# Altium project UKU205V2.PRJPCB
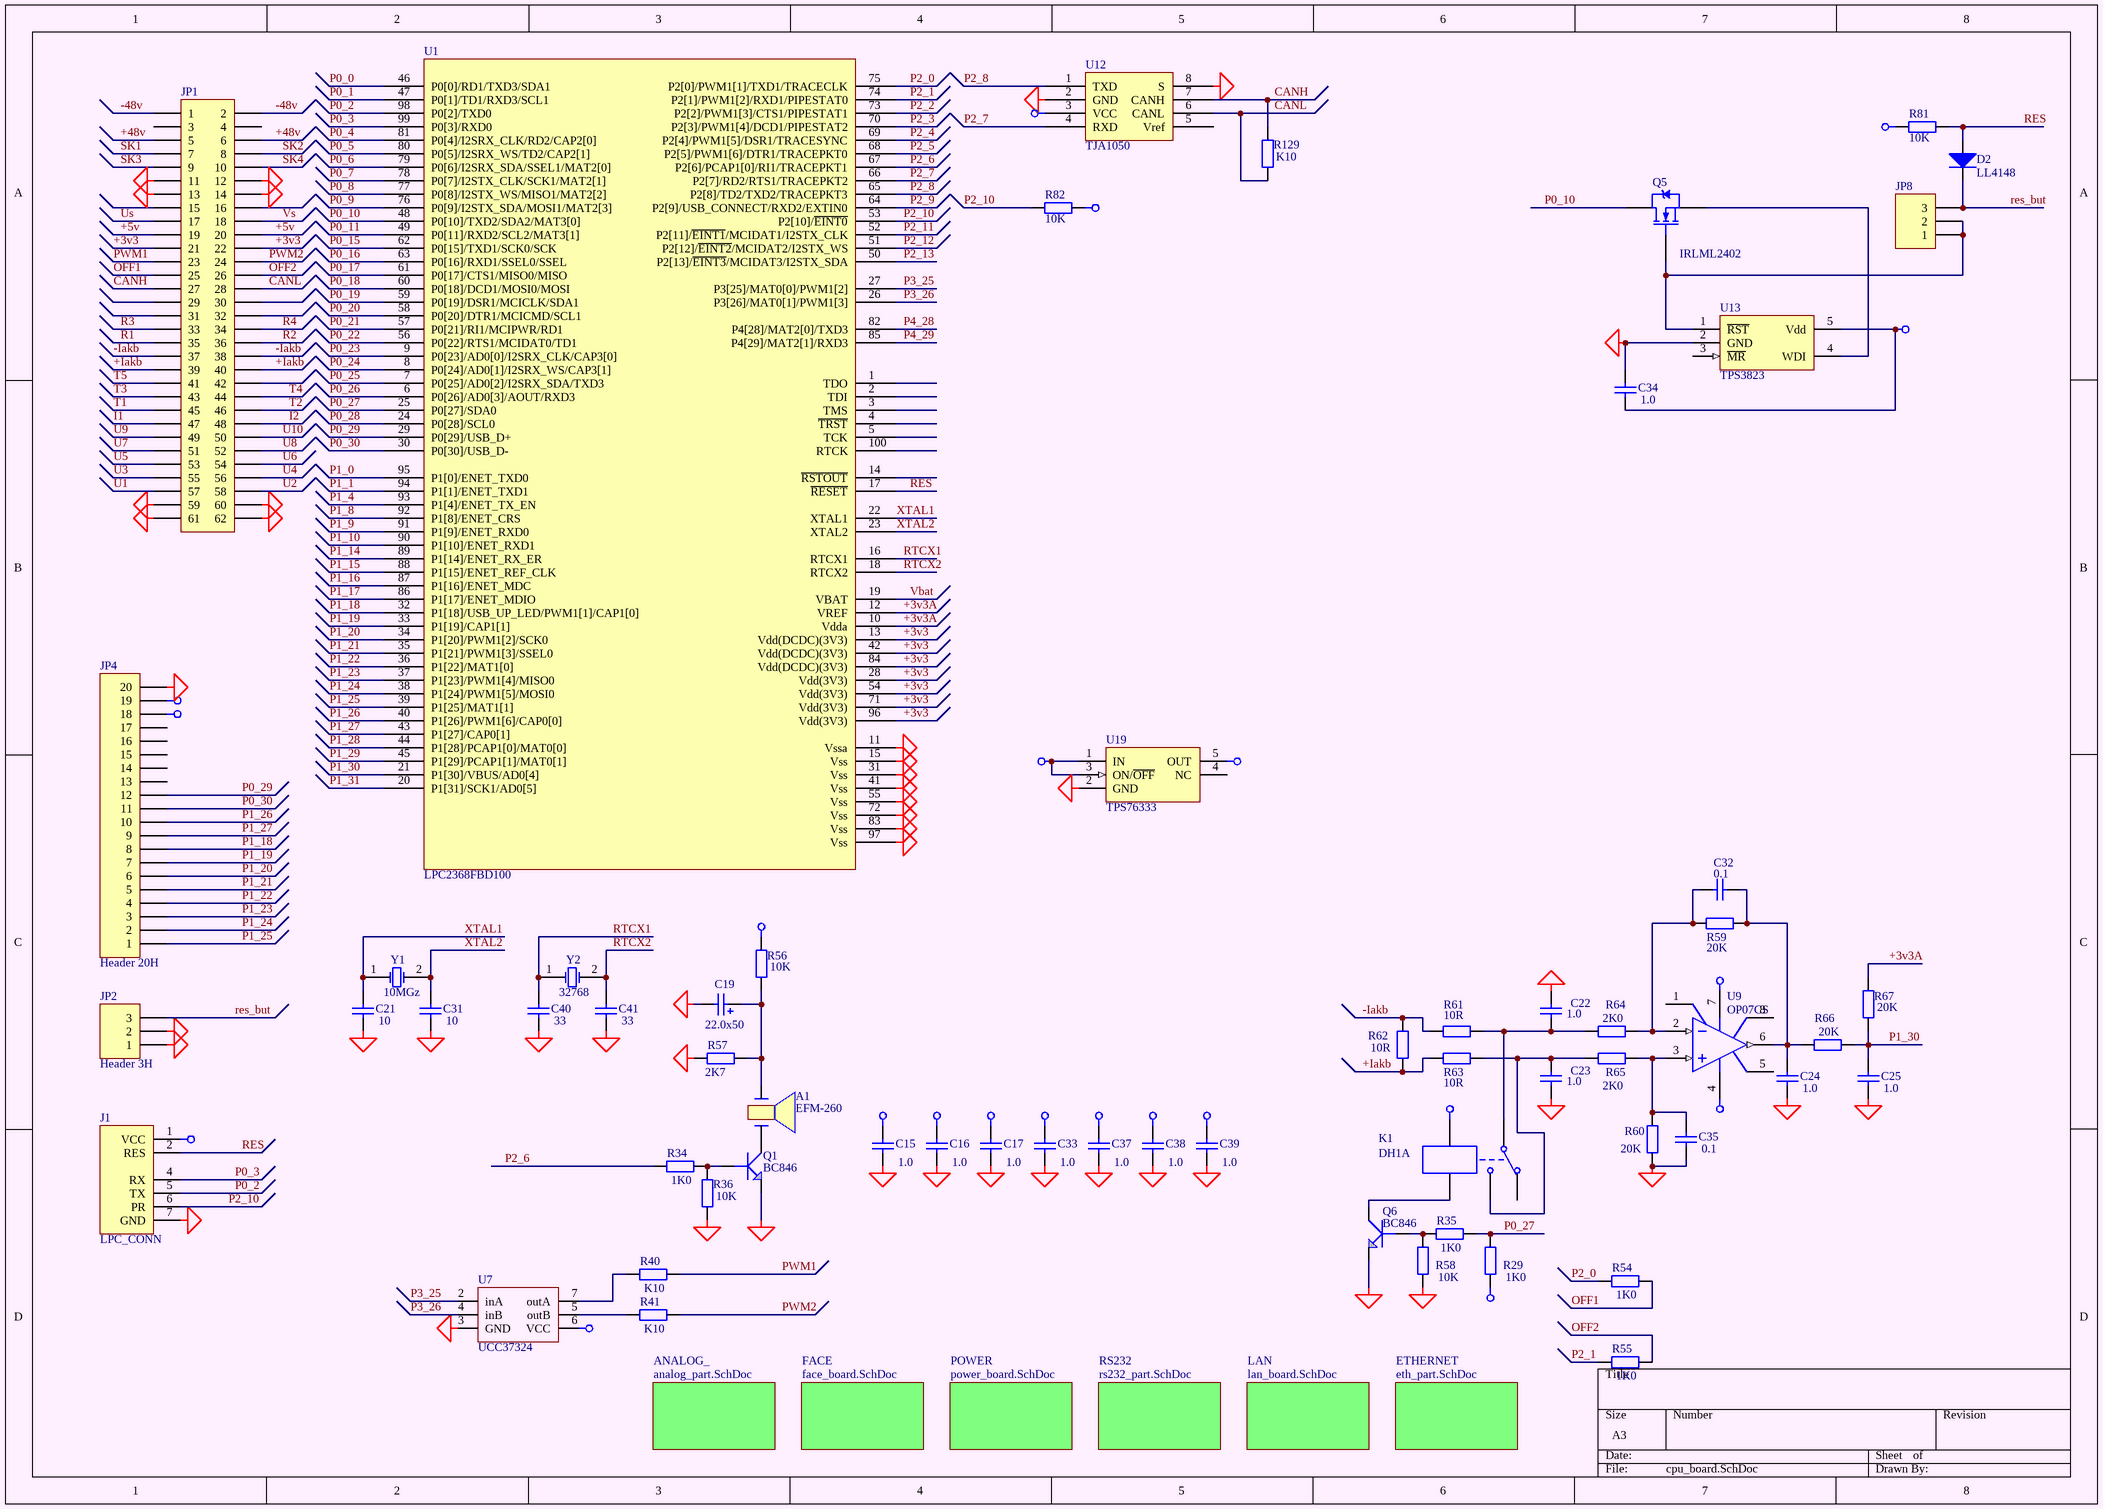
[diagram p0: cpu_board.SchDoc]
6 sheets, 250 parts. Net scope: global (net labels, ports and power ports of the same name join across sheets).
Board file: UKU205.PcbDoc
Sheets:
  cpu_board.SchDoc
    POWER = power_board.SchDoc
    LAN = lan_board.SchDoc
    ETHERNET = eth_part.SchDoc
    FACE = face_board.SchDoc
    ANALOG_ = analog_part.SchDoc

## Sheet cpu_board.SchDoc
size A3

### Parts
A1  EFM-260  [Pjezo15]
C15  1.0  [C3216-1206]
C16  1.0  [C3216-1206]
C17  1.0  [_1206]
C19  22.0x50  [el3]
C21  10  [_1206]
C22  1.0  [_1206]
C23  1.0  [_1206]
C24  1.0  [_1206]
C25  1.0  [_1206]
C31  10  [_1206]
C32  0.1  [_1206]
C33  1.0  [_1206]
C34  1.0  [_1206]
C35  0.1  [_1206]
C37  1.0  [_1206]
C38  1.0  [_1206]
C39  1.0  [_1206]
C40  33  [_1206]
C41  33  [_1206]
D2  LL4148  [_1206d]
J1  LPC_CONN  [HDR1X7]
JP1  (no value)  [HDR2X30]
JP2  Header 3H  [HDR1X3H]
JP4  Header 20H  [HDR1X20H]
JP8  PLS-3  [HDR1X3]  (value not drawn)
K1  DH1A  [kuan]
Q1  BC846  [SO-G3]
Q5  IRLML2402  [SO-G3]
Q6  BC846  [SO-G3]
R29  1K0  [_1206]
R34  1K0  [_1206]
R35  1K0  [_1206]
R36  10K  [_1206]
R40  K10  [_1206]
R41  K10  [_1206]
R54  1K0  [_1206]
R55  1K0  [_1206]
R56  10K  [_1206]
R57  2K7  [_1206]
R58  10K  [_1206]
R59  20K  [_1206]
R60  20K  [_1206]
R61  10R  [_1206]
R62  10R  [_1206]
R63  10R  [_1206]
R64  2K0  [_1206]
R65  2K0  [_1206]
R66  20K  [_1206]
R67  20K  [_1206]
R81  10K  [_1206]
R82  10K  [_1206]
R129  K10  [_1206]
U1  LPC2368FBD100  [LPC2368]
U7  UCC37324  [SO-G8]
U9  OP07CS  [SO-G8]
U12  TJA1050  [SO-G8]
U13  TPS3823  [SO-G5/P.95]
U19  TPS76333  [SO-G5/P.95]
Y1  10MGz  [QWARZ1]
Y2  32768  [QWARZ2]

### Sub-sheets
ANALOG_ = analog_part.SchDoc: no entries
ETHERNET = eth_part.SchDoc: no entries
FACE = face_board.SchDoc: no entries
LAN = lan_board.SchDoc: no entries
POWER = power_board.SchDoc: no entries
RS232 = rs232_part.SchDoc (file not in this document): no entries

### Nets
+3v3: C34.1 C37.2 C38.2 C39.2 J1.1(VCC) JP1.21 JP1.22 R81.2 R82.1 U1.13(Vdd(DCDC)(3V3)) U1.28(Vdd(3V3)) U1.42(Vdd(DCDC)(3V3)) U1.54(Vdd(3V3)) U1.71(Vdd(3V3)) U1.84(Vdd(DCDC)(3V3)) U1.96(Vdd(3V3)) U13.5(Vdd)
+3v3A: C17.2 C33.2 R67.2 U1.10(Vdda) U1.12(VREF) U19.5(OUT)
+5v: C15.2 JP1.19 JP1.20 JP4.19 K1.4 R29.1 U7.6(VCC) U9.7(V+) U12.3(VCC) U19.1(IN) U19.3(ON/~{OFF})
+48v: JP1.5 JP1.6 R56.2
-5v: C16.2 JP4.18 U9.4(V-)
GND: C15.1 C16.1 C17.1 C19.2 C21.1 C22.1 C23.2 C24.1 C25.1 C31.1 C33.1 C34.2 C35.2 C37.1 C38.1 C39.1 C40.1 C41.1 J1.7(GND) JP1.11 JP1.12 JP1.13 JP1.14 JP1.59 JP1.60 JP1.61 JP1.62 JP2.1 JP2.2 JP4.20 Q1.2(E) Q6.2(E) R36.1 R57.1 R58.1 R60.1 U1.11(Vssa) U1.15(Vss) U1.31(Vss) U1.41(Vss) U1.55(Vss) U1.72(Vss) U1.83(Vss) U1.97(Vss) U7.3(GND) U12.2(GND) U12.8(S) U13.2(GND) U19.2(GND)
+Iakb: JP1.39 JP1.40 R62.1 R63.2
-48v: JP1.1 JP1.2
-Iakb: JP1.37 JP1.38 R61.2 R62.2
CANH: JP1.27 R129.2 U12.7(CANH)
CANL: JP1.28 R129.1 U12.6(CANL)
I1: JP1.47
I2: JP1.48
OFF1: JP1.25 R54.2
OFF2: JP1.26 R55.2
P0_0: U1.46(P0[0]/RD1/TXD3/SDA1)
P0_1: U1.47(P0[1]/TD1/RXD3/SCL1)
P0_2: J1.5(TX) U1.98(P0[2]/TXD0)
P0_3: J1.4(RX) U1.99(P0[3]/RXD0)
P0_4: U1.81(P0[4]/I2SRX_CLK/RD2/CAP2[0])
P0_5: U1.80(P0[5]/I2SRX_WS/TD2/CAP2[1])
P0_6: U1.79(P0[6]/I2SRX_SDA/SSEL1/MAT2[0])
P0_7: U1.78(P0[7]/I2STX_CLK/SCK1/MAT2[1])
P0_8: U1.77(P0[8]/I2STX_WS/MISO1/MAT2[2])
P0_9: U1.76(P0[9]/I2STX_SDA/MOSI1/MAT2[3])
P0_10: Q5.3(D) U1.48(P0[10]/TXD2/SDA2/MAT3[0])
P0_11: U1.49(P0[11]/RXD2/SCL2/MAT3[1])
P0_15: U1.62(P0[15]/TXD1/SCK0/SCK)
P0_16: U1.63(P0[16]/RXD1/SSEL0/SSEL)
P0_17: U1.61(P0[17]/CTS1/MISO0/MISO)
P0_18: U1.60(P0[18]/DCD1/MOSI0/MOSI)
P0_19: U1.59(P0[19]/DSR1/MCICLK/SDA1)
P0_20: U1.58(P0[20]/DTR1/MCICMD/SCL1)
P0_21: U1.57(P0[21]/RI1/MCIPWR/RD1)
P0_22: U1.56(P0[22]/RTS1/MCIDAT0/TD1)
P0_23: U1.9(P0[23]/AD0[0]/I2SRX_CLK/CAP3[0])
P0_24: U1.8(P0[24]/AD0[1]/I2SRX_WS/CAP3[1])
P0_25: U1.7(P0[25]/AD0[2]/I2SRX_SDA/TXD3)
P0_26: U1.6(P0[26]/AD0[3]/AOUT/RXD3)
P0_27: R29.2 R35.1 U1.25(P0[27]/SDA0)
P0_28: U1.24(P0[28]/SCL0)
P0_29: JP4.12 U1.29(P0[29]/USB_D+)
P0_30: JP4.11 U1.30(P0[30]/USB_D-)
P1_0: U1.95(P1[0]/ENET_TXD0)
P1_1: U1.94(P1[1]/ENET_TXD1)
P1_4: U1.93(P1[4]/ENET_TX_EN)
P1_8: U1.92(P1[8]/ENET_CRS)
P1_9: U1.91(P1[9]/ENET_RXD0)
P1_10: U1.90(P1[10]/ENET_RXD1)
P1_14: U1.89(P1[14]/ENET_RX_ER)
P1_15: U1.88(P1[15]/ENET_REF_CLK)
P1_16: U1.87(P1[16]/ENET_MDC)
P1_17: U1.86(P1[17]/ENET_MDIO)
P1_18: JP4.8 U1.32(P1[18]/USB_UP_LED/PWM1[1]/CAP1[0])
P1_19: JP4.7 U1.33(P1[19]/CAP1[1])
P1_20: JP4.6 U1.34(P1[20]/PWM1[2]/SCK0)
P1_21: JP4.5 U1.35(P1[21]/PWM1[3]/SSEL0)
P1_22: JP4.4 U1.36(P1[22]/MAT1[0])
P1_23: JP4.3 U1.37(P1[23]/PWM1[4]/MISO0)
P1_24: JP4.2 U1.38(P1[24]/PWM1[5]/MOSI0)
P1_25: JP4.1 U1.39(P1[25]/MAT1[1])
P1_26: JP4.10 U1.40(P1[26]/PWM1[6]/CAP0[0])
P1_27: JP4.9 U1.43(P1[27]/CAP0[1])
P1_28: U1.44(P1[28]/PCAP1[0]/MAT0[0])
P1_29: U1.45(P1[29]/PCAP1[1]/MAT0[1])
P1_30: C25.2 R66.2 R67.1 U1.21(P1[30]/VBUS/AD0[4])
P1_31: U1.20(P1[31]/SCK1/AD0[5])
P2_0: R54.1 U1.75(P2[0]/PWM1[1]/TXD1/TRACECLK)
P2_1: R55.1 U1.74(P2[1]/PWM1[2]/RXD1/PIPESTAT0)
P2_2: U1.73(P2[2]/PWM1[3]/CTS1/PIPESTAT1)
P2_3: U1.70(P2[3]/PWM1[4]/DCD1/PIPESTAT2)
P2_4: U1.69(P2[4]/PWM1[5]/DSR1/TRACESYNC)
P2_5: U1.68(P2[5]/PWM1[6]/DTR1/TRACEPKT0)
P2_6: R34.1 U1.67(P2[6]/PCAP1[0]/RI1/TRACEPKT1)
P2_7: U1.66(P2[7]/RD2/RTS1/TRACEPKT2) U12.4(RXD)
P2_8: U1.65(P2[8]/TD2/TXD2/TRACEPKT3) U12.1(TXD)
P2_9: U1.64(P2[9]/USB_CONNECT/RXD2/EXTIN0)
P2_10: J1.6(PR) R82.2 U1.53(P2[10]/~{EINT0})
P2_11: U1.52(P2[11]/~{EINT1}/MCIDAT1/I2STX_CLK)
P2_12: U1.51(P2[12]/~{EINT2}/MCIDAT2/I2STX_WS)
P2_13: U1.50(P2[13]/~{EINT3}/MCIDAT3/I2STX_SDA)
P3_25: U1.27(P3[25]/MAT0[0]/PWM1[2]) U7.2(inA)
P3_26: U1.26(P3[26]/MAT0[1]/PWM1[3]) U7.4(inB)
P4_28: U1.82(P4[28]/MAT2[0]/TXD3)
P4_29: U1.85(P4[29]/MAT2[1]/RXD3)
PWM1: JP1.23 R40.1
PWM2: JP1.24 R41.1
R1: JP1.35
R2: JP1.36
R3: JP1.33
R4: JP1.34
RES: D2.1(A) J1.2(RES) R81.1 U1.17(~{RESET})
res_but: D2.2(K) JP2.3 JP8.3
RTCX1: C40.2 U1.16(RTCX1) Y2.1(OSC1)
RTCX2: C41.2 U1.18(RTCX2) Y2.2(OSC2)
SK1: JP1.7
SK2: JP1.8
SK3: JP1.9
SK4: JP1.10
T1: JP1.45
T2: JP1.46
T3: JP1.43
T4: JP1.44
T5: JP1.41
U1: JP1.57
U2: JP1.58
U3: JP1.55
U4: JP1.56
U5: JP1.53
U6: JP1.54
U7: JP1.51
U8: JP1.52
U9: JP1.49
U10: JP1.50
Us: JP1.17
Vbat: U1.19(VBAT)
Vs: JP1.18
XTAL1: C21.2 U1.22(XTAL1) Y1.1(OSC1)
XTAL2: C31.2 U1.23(XTAL2) Y1.2(OSC2)
NetA1_1: A1.1 Q1.3(C)
NetA1_2: A1.2 C19.1 R56.1 R57.2
NetC22_2: C22.2 K1.1 R61.1 R64.1
NetC23_1: C23.1 K1.3 R63.1 R65.1
NetC24_2: C24.2 C32.2 R59.1 R66.1 U9.6(OUT)
NetC32_1: C32.1 R59.2 R64.2 U9.2(IN-)
NetC35_1: C35.1 R60.2 R65.2 U9.3(IN+)
NetJP8_1: JP8.1 JP8.2 Q5.1(G) U13.1(~{RST})
NetK1_5: K1.5 Q6.3(C)
NetQ1_1: Q1.1(B) R34.2 R36.2
NetQ5_2: Q5.2(S) U13.4(WDI)
NetQ6_1: Q6.1(B) R35.2 R58.2
NetR40_2: R40.2 U7.7(outA)
NetR41_2: R41.2 U7.5(outB)

Not connected (* = marked no-connect by the designer): JP1 3 4 15 16 29 30 31 32 42; JP4 13 14 15 16 17; K1 2; U1 1(TDO) 2(TDI) 3(TMS) 4(~{TRST}) 5(TCK) 14(~{RSTOUT}) 100(RTCK); U9 1(VOSTRIM) 5(NC) 8(VOSTRIM); U12 5(Vref); U13 3(~{MR}); U19 4(NC)

### Library data of the parts
A1 = PJEZ0
C15-C17 C32 C33 C35 C37-C39 = Cap Semi: Capacitor (Semiconductor SIM Model); Manufacturer: Generic Components; Class I: Passive; Value: 0,1; Published: 8-Jun-2000; Revision: July-2002: Re-released for DXP Platform.; Publisher: Altium Limited; Class II: Capacitor
C19 = Cap Pol1: Polarized Capacitor (Radial); Manufacturer: Generic Components; Class I: Passive; Value: 22,0; Published: 8-Jun-2000; Revision: July-2002: Re-released for DXP Platform.; Publisher: Altium Limited; Class II: Capacitor
C21 C31 C40 C41 = Cap Semi: Capacitor (Semiconductor SIM Model); Manufacturer: Generic Components; Class I: Passive; Value: 15pF; Published: 8-Jun-2000; Revision: July-2002: Re-released for DXP Platform.; Publisher: Altium Limited; Class II: Capacitor
C22-C25 = Cap Semi: Capacitor (Semiconductor SIM Model); Manufacturer: Generic Components; Class I: Passive; Value: 1,0; Published: 8-Jun-2000; Revision: July-2002: Re-released for DXP Platform.; Publisher: Altium Limited; Class II: Capacitor
C34 = Cap Semi: Capacitor; Manufacturer: Generic Components; Class I: Passive; Value: 0,1; Published: 8-Jun-2000; Revision: July-2002: Re-released for DXP Platform.; Publisher: Altium Limited; Class II: Capacitor
D2 = Diode: Default Diode; Manufacturer: Generic Components; Class I: Discrete; Class II: Diode - Switching; Published: 8-Jun-2000; Revision: July-2002: Re-released for DXP Platform.; Publisher: Altium Limited
JP1 = Header 31X2: Header, 30-Pin, Dual row; Manufacturer: Generic Components; Class I: Connector; Revision: July-2002: Re-released for DXP Platform.; Publisher: Altium Limited
JP2 = Header 3H: Header, 3-Pin,  Right Angle; Manufacturer: Generic Components; Class I: Connector; Revision: July-2002: Re-released for DXP Platform.; Publisher: Altium Limited
JP4 = Header 20H: Header, 20-Pin,  Right Angle; Manufacturer: Generic Components; Class I: Connector; Revision: July-2002: Re-released for DXP Platform.; Publisher: Altium Limited
JP8 = Header 3: Header, 3-Pin; Manufacturer: Generic Components; Class I: Connector; Revision: July-2002: Re-released for DXP Platform.; Publisher: Altium Limited
K1 = BS115: Single-Pole Dual-Throw Relay; Manufacturer: Generic Components; Class I: Electro-mechanical; Published: 24-Mar-1999; Revision: July-2002: Re-released for DXP Platform.; Publisher: Altium Limited; Class II: Relay
Q1 Q6 = GT122: Right: 20; Bottom: 20
Q5 = IRLML2402: HEXFET Power MOSFET; Manufacturer: International Rectifier; Class I: Discrete; Class II: MOSFET - Power; Published: 8-Jun-2000; Revision: July-2002: Re-released for DXP Platform.; Datasheet: Latest Revision: Aug-1997; Package Reference: SOT-23; Publisher: Altium Limited; Value: IRLML2402
R29 = Res2: Resistor; Manufacturer: Generic Components; Class I: Passive; Value: 10K; Published: 8-Jun-2000; Revision: July-2002: Re-released for DXP Platform.; Publisher: Altium Limited; Class II: Resistor
R34 R35 R40 R41 R54-R57 R61-R63 R81 R82 = Res2: Resistor; Manufacturer: Generic Components; Class I: Passive; Rule: Undefined; Published: 8-Jun-2000; Revision: July-2002: Re-released for DXP Platform.; Publisher: Altium Limited; Class II: Resistor
  R34 R35 R54 R55: Value: 1K0
  R40 R41: Value: K10
  R56 R81 R82: Value: 10K
  R57: Value: 2K7
  R61-R63: Value: 10R
R36 R58-R60 R64-R67 = Res2: Resistor; Manufacturer: Generic Components; Class I: Passive; Published: 8-Jun-2000; Revision: July-2002: Re-released for DXP Platform.; Publisher: Altium Limited; Class II: Resistor
  R36 R58: Value: 10K
  R59 R60 R66 R67: Value: 20K
  R64 R65: Value: 2K0
R129 = Res2: Resistor; Manufacturer: Generic Components; Class I: Passive; Value: 120; Published: 8-Jun-2000; Revision: July-2002: Re-released for DXP Platform.; Publisher: Altium Limited; Class II: Resistor
U9 = OP07CS: Ultra-Low Offset Voltage Operational Amplifier; Manufacturer: Analog Devices; Note: Pin 5 is not connected.; Published: 8-Jun-2000; Revision: July-2002: Re-released for DXP Platform.; Datasheet: Designer's Reference Manual CD (1992); Package Reference: SO-8B; Publisher: Altium Limited; Class I: Amplifier; Class II: Operational Amplifier
U13 = TPS3823: Reset IC; Manufacturer: National Semiconductor; Package Information: Latest Revision: Aug-1999; Class I: Power Management; Class II: Voltage Regulator; Value: TPS76333; Published: 15-Apr-2002; Datasheet: Latest Revision: Oct-1999; Package Reference: MA05B; Publisher: Altium Limited
U19 = LP2980AIM5-3.3: Micropower SOT, 50 mA Ultra Low-Dropout Regulator; Manufacturer: National Semiconductor; Package Information: Latest Revision: Aug-1999; Class I: Power Management; Class II: Voltage Regulator; Published: 15-Apr-2002; Datasheet: Latest Revision: Oct-1999; Package Reference: MA05B; Publisher: Altium Limited
Y1 Y2 = XTAL: Crystal Oscillator; Manufacturer: Generic Components; Published: 8-Jun-2000; Revision: July-2002: Re-released for DXP Platform.; Publisher: Altium Limited; Class I: Oscillator; Class II: Crystal Oscillator

## Sheet power_board.SchDoc
size A3
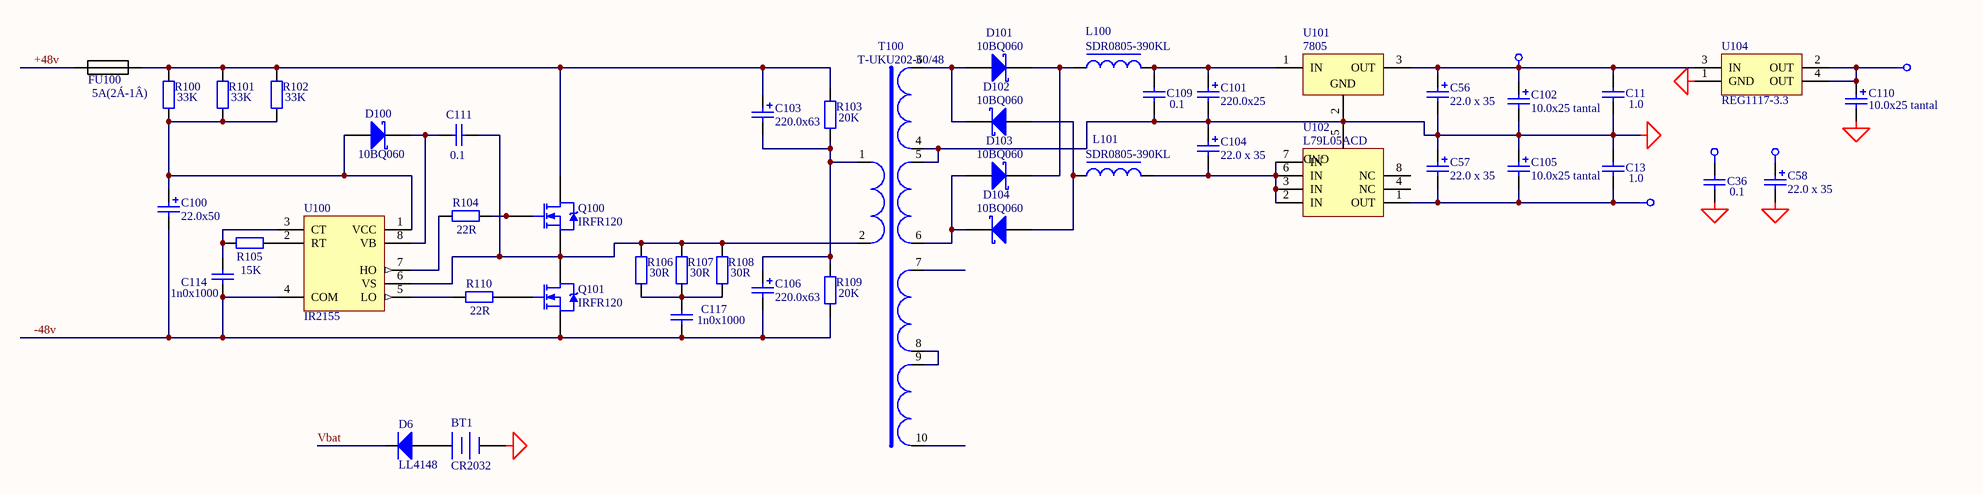
[diagram p1: power_board.SchDoc]

### Parts
BT1  CR2032  [BAT_SUPP]
C11  1.0  [C3216-1206]
C13  1.0  [C3216-1206]
C36  0.1  [C3216-1206]
C56  22.0 x 35  [el3]
C57  22.0 x 35  [el3]
C58  22.0 x 35  [el3]
C100  22.0x50  [el3]
C101  220.0x25  [el5]
C102  10.0x25 tantal  [CAP_EL_6_3]
C103  220.0x63  [el5]
C104  22.0 x 35  [el3]
C105  10.0x25 tantal  [CAP_EL_6_3]
C106  220.0x63  [el5]
C109  0.1  [C3216-1206]
C110  10.0x25 tantal  [CAP_EL_6_3]
C111  0.1  [C3216-1206]
C114  1n0x1000  [_1206]
C117  1n0x1000  [_1206]
D6  LL4148  [_1206d]
D100  10BQ060  [D_6_3]
D101  10BQ060  [D_6_3]
D102  10BQ060  [D_6_3]
D103  10BQ060  [D_6_3]
D104  10BQ060  [D_6_3]
FU100  5A(2Á-1Â)  [FUSE2]
L100  SDR0805-390KL  [L10x10]
L101  SDR0805-390KL  [L10x10]
Q100  IRFR120  [SIP-G3/E8]
Q101  IRFR120  [SIP-G3/E8]
R100  33K  [_1206]
R101  33K  [_1206]
R102  33K  [_1206]
R103  20K  [_1206]
R104  22R  [_1206]
R105  15K  [_1206]
R106  30R  [_1206]
R107  30R  [_1206]
R108  30R  [_1206]
R109  20K  [_1206]
R110  22R  [_1206]
T100  T-UKU202-60/48  [trans_ring1]
U100  IR2155  [DIP-8/D11]
U101  7805  [D2PAK]
U102  L79L05ACD  [SO-G8]
U104  REG1117-3.3  [SIP-G3/C7.4]

### Nets
+3v3: C36.2 C58.1 C110.1 U104.2(OUT) U104.4(OUT)
+5v: C11.2 C56.1 C102.1 U101.3(OUT) U104.3(IN)
+48v: FU100.1
-5v: C13.1 C57.2 C105.2 U102.1(OUT)
GND: BT1.2(-) C11.1 C13.2 C36.1 C56.2 C57.1 C58.2 C101.2 C102.2 C104.1 C105.1 C109.1 C110.2 T100.4(Vss) T100.5(Vss) U101.2(GND) U102.5(GND) U104.1(GND)
-48v: C100.2 C106.2 C114.2 C117.2 Q101.3(S) R109.2 U100.4(COM)
Vbat: D6.2(K)
NetBT1_1: BT1.1(+) D6.1(A)
NetC100_1: C100.1 D100.1(A) R100.2 R101.2 R102.2 U100.1(VCC)
NetC101_1: C101.1 C109.2 L100.2 U101.1(IN)
NetC103_1: C103.1 FU100.2 Q100.4(D) R100.1 R101.1 R102.1 R103.1
NetC103_2: C103.2 C106.1 R103.2 R109.1 T100.1(Vss)
NetC104_2: C104.2 L101.2 U102.2(IN) U102.3(IN) U102.6(IN) U102.7(IN)
NetC111_1: C111.1 D100.2(K) U100.8(VB)
NetC111_2: C111.2 Q100.3(S) Q101.4(D) R106.1 R107.1 R108.1 T100.2(Vss) U100.6(VS)
NetC114_1: C114.1 R105.1 U100.3(CT)
NetC117_1: C117.1 R106.2 R107.2 R108.2
NetD101_1: D101.1(A) D102.2(K) T100.3(Vss)
NetD101_2: D101.2(K) D103.2(K) L100.1
NetD102_1: D102.1(A) D104.1(A) L101.1
NetD103_1: D103.1(A) D104.2(K) T100.6(Vss)
NetQ100_1: Q100.1(G) R104.2
NetQ101_1: Q101.1(G) R110.2
NetR104_1: R104.1 U100.7(HO)
NetR105_2: R105.2 U100.2(RT)
NetR110_1: R110.1 U100.5(LO)
NetT100_8: T100.8(Vss) T100.9(Vss)

Not connected (* = marked no-connect by the designer): T100 7(Vss) 10(Vss); U102 4(NC) 8(NC)

### Library data of the parts
BT1 = Battery: Multicell Battery; Manufacturer: Generic Components; Published: 24-Mar-1999; Revision: July-2002: Re-released for DXP Platform.; Publisher: Altium Limited
C11 C13 C36 C109 C111 = Cap Semi: as C15 on sheet cpu_board; Published: 8-Jun-2000; Revision: July-2002: Re-released for DXP Platform.; Publisher: Altium Limited; Class II: Capacitor
C56-C58 C102 C104 C105 C110 = Cap Pol1: Polarized Capacitor (Radial); Manufacturer: Generic Components; Class I: Passive; Value: 10,0x25; Published: 8-Jun-2000; Revision: July-2002: Re-released for DXP Platform.; Publisher: Altium Limited; Class II: Capacitor
C100 = Cap Pol1: Polarized Capacitor (Radial); Manufacturer: Generic Components; Class I: Passive; Value: 22,0x50; Published: 8-Jun-2000; Revision: July-2002: Re-released for DXP Platform.; Publisher: Altium Limited; Class II: Capacitor
C101 = Cap Pol1: Polarized Capacitor (Radial); Manufacturer: Generic Components; Class I: Passive; Value: 220,0x25; Published: 8-Jun-2000; Revision: July-2002: Re-released for DXP Platform.; Publisher: Altium Limited; Class II: Capacitor
C103 C106 = Cap Pol1: Polarized Capacitor (Radial); Manufacturer: Generic Components; Class I: Passive; Value: 220,0x63; Published: 8-Jun-2000; Revision: July-2002: Re-released for DXP Platform.; Publisher: Altium Limited; Class II: Capacitor
C114 C117 = Cap Semi: Capacitor (Semiconductor SIM Model); Manufacturer: Generic Components; Class I: Passive; Value: 1000; Published: 8-Jun-2000; Revision: July-2002: Re-released for DXP Platform.; Publisher: Altium Limited; Class II: Capacitor
D6 = Diode: as D2 on sheet cpu_board; Published: 8-Jun-2000; Revision: July-2002: Re-released for DXP Platform.; Publisher: Altium Limited
D100-D104 = 10BQ015: Schottky Rectifier; Manufacturer: International Rectifier; Revision 1: 10-July-2000: SIM Model Added.; Revision 2: July-2002: Re-released for DXP Platform.; Class I: Discrete; Class II: Rectifier - Schottky; Published: 8-Jun-2000; Datasheet: Latest Revision: PD-2.396A; Package Reference: DO-214AA; Publisher: Altium Limited
FU100 = FUSE
L100 L101 = Inductor Konstr 2: Magnetic-Core Inductor; Manufacturer: Generic Components; Class I: Passive; Published: 24-Mar-1999; Revision: July-2002: Re-released for DXP Platform.; Publisher: Altium Limited; Class II: Inductor
Q100 Q101 = IRFR120: HEXFET N-Channel Power MOSFET; Manufacturer: International Rectifier; Revision 1: 10-July-2000: SIM Model Added.; Revision 2: July-2002: Re-released for DXP Platform.; Class I: Discrete; Class II: MOSFET - Power; Note: Pin 2 is trimmed and is electrically connected to Drain.; Published: 8-Jun-2000; Datasheet: Latest Revision: PD-9.523D; Package Reference: TO-252AA; Publisher: Altium Limited
R100-R103 R105 R109 = Res2: as R34 on sheet cpu_board; Published: 8-Jun-2000; Revision: July-2002: Re-released for DXP Platform.; Publisher: Altium Limited; Class II: Resistor
  R100-R102: Value: 33K
  R103 R109: Value: 20K
  R105: Value: 15K
R104 R110 = Res2: Resistor; Manufacturer: Generic Components; Class I: Passive; Value: 22; Rule: Undefined; Published: 8-Jun-2000; Revision: July-2002: Re-released for DXP Platform.; Publisher: Altium Limited; Class II: Resistor
R106-R108 = Res2: Resistor; Manufacturer: Generic Components; Class I: Passive; Value: 30; Rule: Undefined; Published: 8-Jun-2000; Revision: July-2002: Re-released for DXP Platform.; Publisher: Altium Limited; Class II: Resistor
T100 = TRANS_RING1
U100 = IR2155: Self-Oscillating Half-Bridge Driver; Manufacturer: International Rectifier; Class I: Interface; Published: 8-Jun-2000; Revision: July-2002: Re-released for DXP Platform.; Datasheet: Latest Revision: PD60029I; Package Reference: PDIP8; Publisher: Altium Limited; Class II: Bridge Driver
U101 = 7805: 3-Terminal Positive Fixed Voltage Regulator; Manufacturer: Motorola; Class I: Power Management; Note: Pin 2 is electrically connected to TAB; Published: 15-Apr-2002; Datasheet: Linear and Interface Integrated Circuits, DL128 Rev2 (1988); Package Reference: 221A-04; Publisher: Altium Limited; Class II: Voltage Regulator
U102 = L79L05ACD: Negative Voltage Regulator; Manufacturer: ST-Microelectronics; Package Information: Latest Revision: Jul-1998; Class I: Power Management; Published: 24-Aug-2001; Revision: July-2002: Re-released for DXP Platform.; Datasheet: Latest Revision: Apr-1999; Package Reference: SO8; Publisher: Altium Limited; Class II: Voltage Regulator
U104 = REG1117-3.3: 800mA and 1A Low Dropout Positive Regulator 2.85V, 3.3V, 5V, and Adjustable; Manufacturer: Burr-Brown; Package Information: Latest Revision: Rev. C; Class I: Power Management; Class II: Voltage Regulator; Published: 8-Jun-2000; Revision: July-2002: Re-released for DXP Platform.; Datasheet: Latest Revision: Sep-1997; Package Reference: ZZ311; Publisher: Altium Limited

## Sheet lan_board.SchDoc
size A4
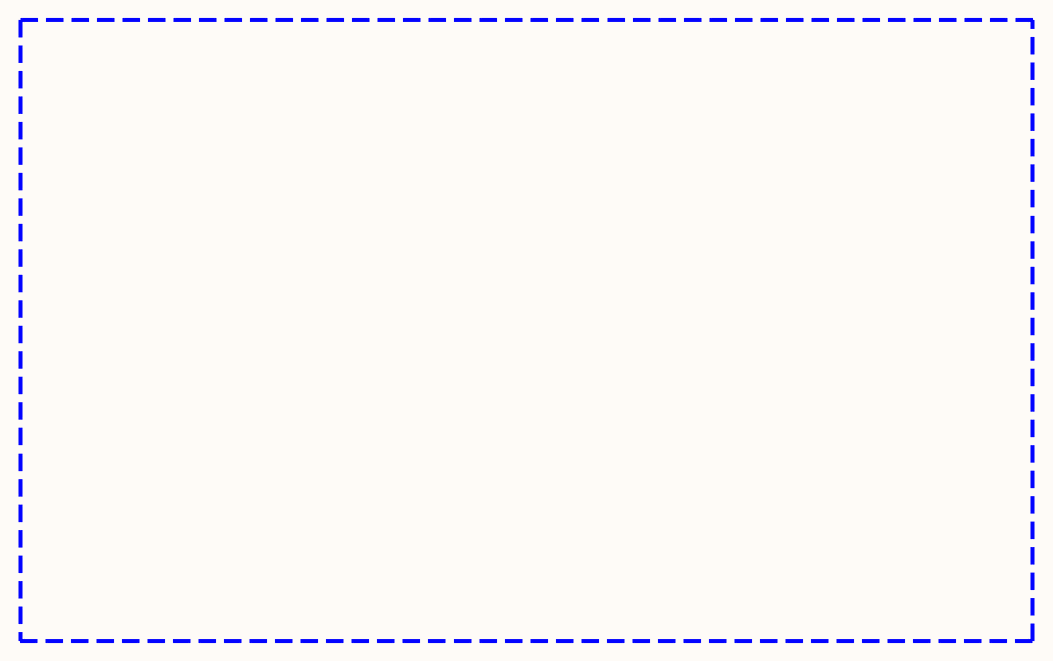
[diagram p2: lan_board.SchDoc]

## Sheet eth_part.SchDoc
size A3
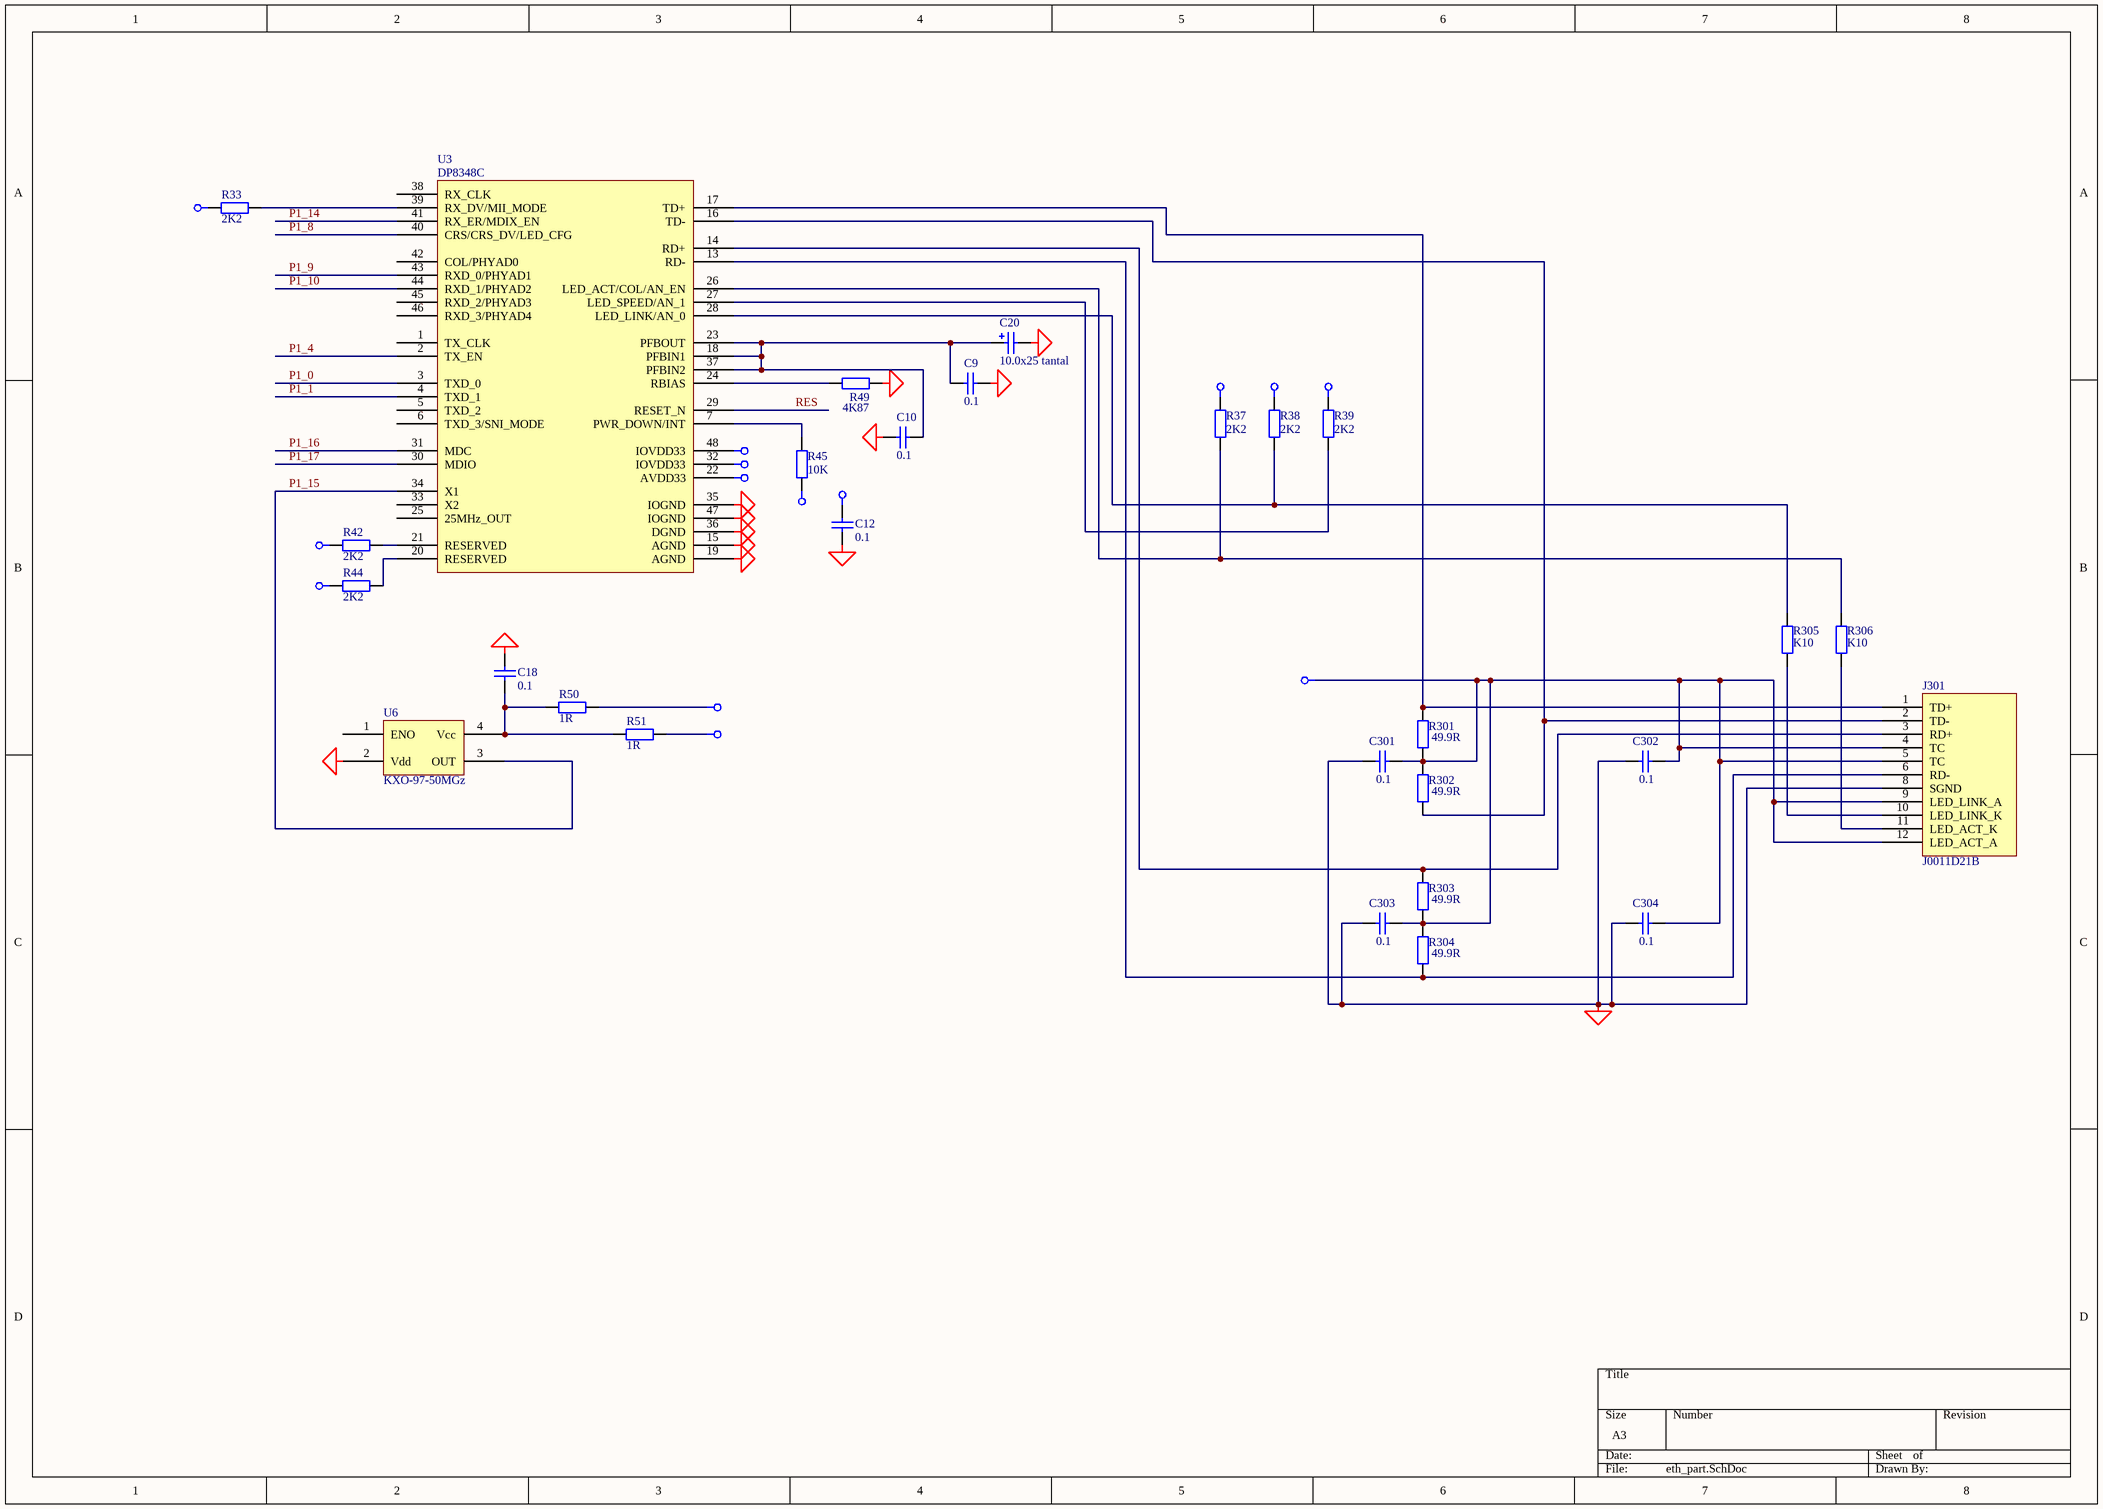
[diagram p3: eth_part.SchDoc]

### Parts
C9  0.1  [C3216-1206]
C10  0.1  [C3216-1206]
C12  0.1  [_1206]
C18  0.1  [_1206]
C20  10.0x25 tantal  [CAP_EL_6_3]
C301  0.1  [C3216-1206]
C302  0.1  [C3216-1206]
C303  0.1  [C3216-1206]
C304  0.1  [C3216-1206]
J301  J0011D21B  [J0011D21B]
R33  2K2  [_1206]
R37  2K2  [_1206]
R38  2K2  [_1206]
R39  2K2  [_1206]
R42  2K2  [_1206]
R44  2K2  [_1206]
R45  10K  [_1206]
R49  4K87  [_1206]
R50  1R  [_1206]
R51  1R  [_1206]
R301  49.9R  [_1206]
R302  49.9R  [_1206]
R303  49.9R  [_1206]
R304  49.9R  [_1206]
R305  K10  [_1206]
R306  K10  [_1206]
U3  DP8348C  [F-QFP7X7-G48/N]
U6  KXO-97-50MGz  [KXO-97]

### Nets
+3v3: C12.1 C301.2 C302.2 C303.2 C304.2 J301.4(TC) J301.5(TC) J301.9(LED_LINK_A) J301.12(LED_ACT_A) R33.2 R37.2 R38.2 R39.2 R42.2 R44.2 R45.2 R51.2 R301.2 R302.1 R303.2 R304.1 U3.22(AVDD33) U3.32(IOVDD33) U3.48(IOVDD33)
+5v: R50.2
GND: C9.2 C10.2 C12.2 C18.2 C20.2 C301.1 C302.1 C303.1 C304.1 J301.8(SGND) R49.1 U3.15(AGND) U3.19(AGND) U3.35(IOGND) U3.36(DGND) U3.47(IOGND) U6.2(Vdd)
P1_0: U3.3(TXD_0)
P1_1: U3.4(TXD_1)
P1_4: U3.2(TX_EN)
P1_8: U3.40(CRS/CRS_DV/LED_CFG)
P1_9: U3.43(RXD_0/PHYAD1)
P1_10: U3.44(RXD_1/PHYAD2)
P1_14: U3.41(RX_ER/MDIX_EN)
P1_15: U3.34(X1) U6.3(OUT)
P1_16: U3.31(MDC)
P1_17: U3.30(MDIO)
RES: U3.29(RESET_N)
NetC9_1: C9.1 C10.1 C20.1 U3.18(PFBIN1) U3.23(PFBOUT) U3.37(PFBIN2)
NetC18_1: C18.1 R50.1 R51.1 U6.4(Vcc)
NetJ301_1: J301.1(TD+) R301.1 U3.17(TD+)
NetJ301_2: J301.2(TD-) R302.2 U3.16(TD-)
NetJ301_3: J301.3(RD+) R303.1 U3.14(RD+)
NetJ301_6: J301.6(RD-) R304.2 U3.13(RD-)
NetJ301_10: J301.10(LED_LINK_K) R305.1
NetJ301_11: J301.11(LED_ACT_K) R306.1
NetR33_1: R33.1 U3.39(RX_DV/MII_MODE)
NetR37_1: R37.1 R306.2 U3.26(LED_ACT/COL/AN_EN)
NetR38_1: R38.1 R305.2 U3.28(LED_LINK/AN_0)
NetR39_1: R39.1 U3.27(LED_SPEED/AN_1)
NetR42_1: R42.1 U3.21(RESERVED)
NetR44_1: R44.1 U3.20(RESERVED)
NetR45_1: R45.1 U3.7(PWR_DOWN/INT)
NetR49_2: R49.2 U3.24(RBIAS)

Not connected (* = marked no-connect by the designer): U3 1(TX_CLK) 5(TXD_2) 6(TXD_3/SNI_MODE) 25(25MHz_OUT) 33(X2) 38(RX_CLK) 42(COL/PHYAD0) 45(RXD_2/PHYAD3) 46(RXD_3/PHYAD4); U6 1(ENO)

### Library data of the parts
C9 C10 C12 C18 C301-C304 = Cap Semi: as C22 on sheet cpu_board; Published: 8-Jun-2000; Revision: July-2002: Re-released for DXP Platform.; Publisher: Altium Limited; Class II: Capacitor
C20 = Cap Pol1: as C56 on sheet power_board; Published: 8-Jun-2000; Revision: July-2002: Re-released for DXP Platform.; Publisher: Altium Limited; Class II: Capacitor
R33 R37-R39 R42 R44 R49-R51 = Res2: Resistor; Manufacturer: Generic Components; Class I: Passive; Value: 10K; Rule: Undefined; Published: 8-Jun-2000; Revision: July-2002: Re-released for DXP Platform.; Publisher: Altium Limited; Class II: Resistor
R45 = Res2: as R34 on sheet cpu_board; Published: 8-Jun-2000; Revision: July-2002: Re-released for DXP Platform.; Publisher: Altium Limited; Class II: Resistor; Value: 10K
R301-R306 = Res2: as R106 on sheet power_board; Published: 8-Jun-2000; Revision: July-2002: Re-released for DXP Platform.; Publisher: Altium Limited; Class II: Resistor
U6 = KXO-97

## Sheet face_board.SchDoc
size A3
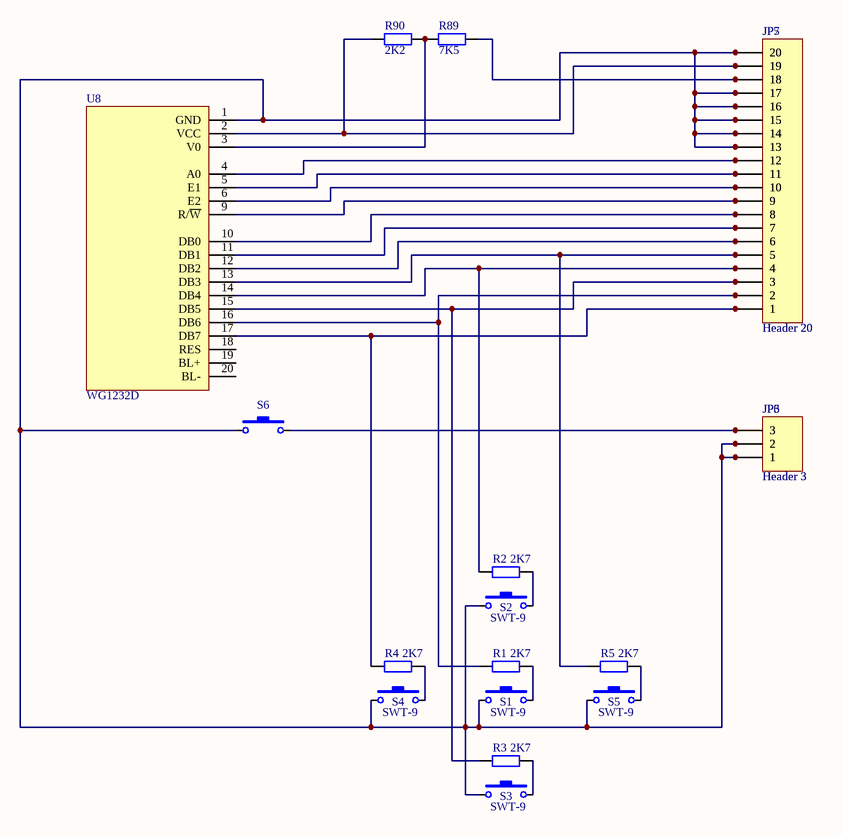
[diagram p4: face_board.SchDoc]

### Parts
JP3  Header 3  [HDR1X3]
JP5  Header 20  [HDR1X20]
JP6  Header 3  [HDR1X3]
JP7  Header 20  [HDR1X20]
R1  2K7  [_1206]
R2  2K7  [_1206]
R3  2K7  [_1206]
R4  2K7  [_1206]
R5  2K7  [_1206]
R89  7K5  [_1206]
R90  2K2  [_1206]
S1  SWT-9  [SWT-9]
S2  SWT-9  [SWT-9]
S3  SWT-9  [SWT-9]
S4  SWT-9  [SWT-9]
S5  SWT-9  [SWT-9]
S6  SWT-6  [SWT-6]  (value not drawn)
U8  WG1232D  [WG1232D]

### Nets
NetJP3_1: JP3.1 JP3.2 JP5.13 JP5.14 JP5.15 JP5.16 JP5.17 JP5.20 JP6.1 JP6.2 JP7.13 JP7.14 JP7.15 JP7.16 JP7.17 JP7.20 S1.1 S2.1 S3.1 S4.1 S5.1 S6.1 U8.1(GND)
NetJP3_3: JP3.3 JP6.3 S6.2
NetJP5_1: JP5.1 JP7.1 R4.2 U8.17(DB7)
NetJP5_2: JP5.2 JP7.2 R1.2 U8.16(DB6)
NetJP5_3: JP5.3 JP7.3 R3.2 U8.15(DB5)
NetJP5_4: JP5.4 JP7.4 R2.2 U8.14(DB4)
NetJP5_5: JP5.5 JP7.5 R5.2 U8.13(DB3)
NetJP5_6: JP5.6 JP7.6 U8.12(DB2)
NetJP5_7: JP5.7 JP7.7 U8.11(DB1)
NetJP5_8: JP5.8 JP7.8 U8.10(DB0)
NetJP5_9: JP5.9 JP7.9 U8.9(R/~{W})
NetJP5_10: JP5.10 JP7.10 U8.6(E2)
NetJP5_11: JP5.11 JP7.11 U8.5(E1)
NetJP5_12: JP5.12 JP7.12 U8.4(A0)
NetJP5_18: JP5.18 JP7.18 R89.1
NetJP5_19: JP5.19 JP7.19 R90.2 U8.2(VCC)
NetR1_1: R1.1 S1.2
NetR2_1: R2.1 S2.2
NetR3_1: R3.1 S3.2
NetR4_1: R4.1 S4.2
NetR5_1: R5.1 S5.2
NetR89_2: R89.2 R90.1 U8.3(V0)

Not connected (* = marked no-connect by the designer): U8 18(RES) 19(BL+) 20(BL-)

### Library data of the parts
JP3 JP6 = Header 3: as JP8 on sheet cpu_board; Revision: July-2002: Re-released for DXP Platform.; Publisher: Altium Limited
JP5 JP7 = Header 20: Header, 20-Pin; Manufacturer: Generic Components; Class I: Connector; Revision: July-2002: Re-released for DXP Platform.; Publisher: Altium Limited
R1-R5 R89 R90 = Res2: as R34 on sheet cpu_board; Published: 8-Jun-2000; Revision: July-2002: Re-released for DXP Platform.; Publisher: Altium Limited; Class II: Resistor
  R1-R5: Value: 2K7
  R89: Value: 7K5
  R90: Value: 2K2
S1-S5 = SWT-9: Switch; Manufacturer: Generic Components; Published: 24-Mar-1999; Revision: July-2002: Re-released for DXP Platform.; Publisher: Altium Limited
S6 = SWT-9: Button; Manufacturer: Generic Components; Published: 24-Mar-1999; Revision: July-2002: Re-released for DXP Platform.; Publisher: Altium Limited; Value: SWT-6
U8 = WG1232D_pereh

## Sheet analog_part.SchDoc
size A3
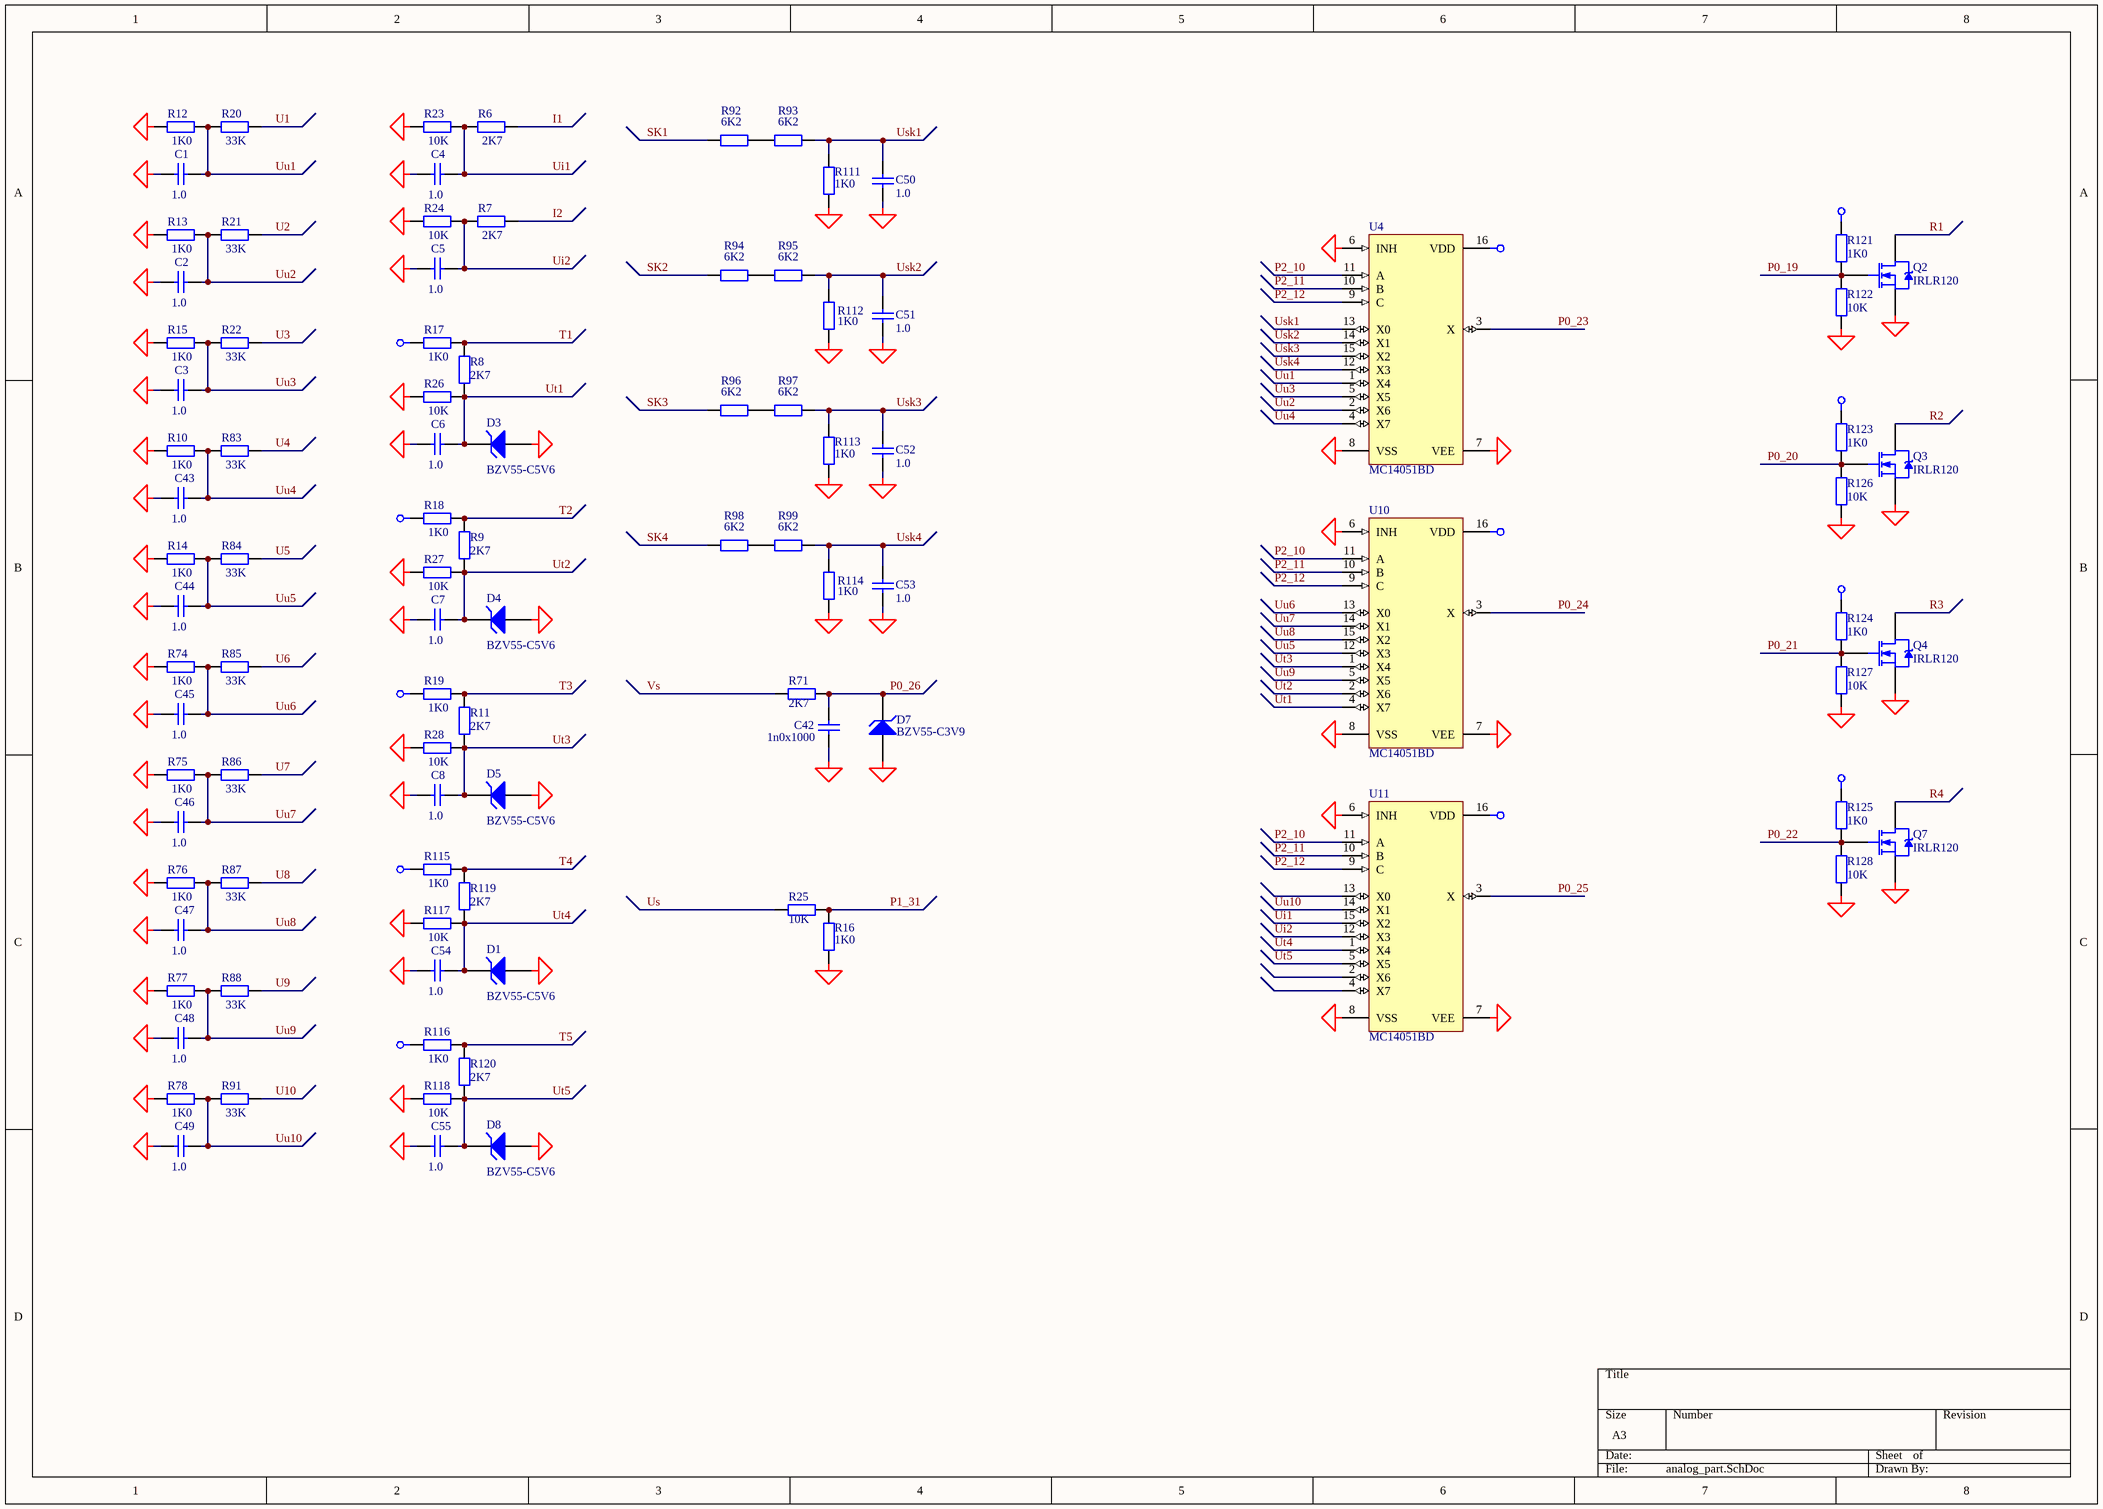
[diagram p5: analog_part.SchDoc]

### Parts
C1  1.0  [_1206]
C2  1.0  [_1206]
C3  1.0  [_1206]
C4  1.0  [_1206]
C5  1.0  [_1206]
C6  1.0  [_1206]
C7  1.0  [_1206]
C8  1.0  [_1206]
C42  1n0x1000  [_1206]
C43  1.0  [_1206]
C44  1.0  [_1206]
C45  1.0  [_1206]
C46  1.0  [_1206]
C47  1.0  [_1206]
C48  1.0  [_1206]
C49  1.0  [_1206]
C50  1.0  [_1206]
C51  1.0  [_1206]
C52  1.0  [_1206]
C53  1.0  [_1206]
C54  1.0  [_1206]
C55  1.0  [_1206]
D1  BZV55-C5V6  [_1206d]
D3  BZV55-C5V6  [_1206d]
D4  BZV55-C5V6  [_1206d]
D5  BZV55-C5V6  [_1206d]
D7  BZV55-C3V9  [_1206d]
D8  BZV55-C5V6  [_1206d]
Q2  IRLR120  [SIP-G3/E8]
Q3  IRLR120  [SIP-G3/E8]
Q4  IRLR120  [SIP-G3/E8]
Q7  IRLR120  [SIP-G3/E8]
R6  2K7  [_1206]
R7  2K7  [_1206]
R8  2K7  [_1206]
R9  2K7  [_1206]
R10  1K0  [_1206]
R11  2K7  [_1206]
R12  1K0  [_1206]
R13  1K0  [_1206]
R14  1K0  [_1206]
R15  1K0  [_1206]
R16  1K0  [_1206]
R17  1K0  [_1206]
R18  1K0  [_1206]
R19  1K0  [_1206]
R20  33K  [_1206]
R21  33K  [_1206]
R22  33K  [_1206]
R23  10K  [_1206]
R24  10K  [_1206]
R25  10K  [_1206]
R26  10K  [_1206]
R27  10K  [_1206]
R28  10K  [_1206]
R71  2K7  [_1206]
R74  1K0  [_1206]
R75  1K0  [_1206]
R76  1K0  [_1206]
R77  1K0  [_1206]
R78  1K0  [_1206]
R83  33K  [_1206]
R84  33K  [_1206]
R85  33K  [_1206]
R86  33K  [_1206]
R87  33K  [_1206]
R88  33K  [_1206]
R91  33K  [_1206]
R92  6K2  [_1206]
R93  6K2  [_1206]
R94  6K2  [_1206]
R95  6K2  [_1206]
R96  6K2  [_1206]
R97  6K2  [_1206]
R98  6K2  [_1206]
R99  6K2  [_1206]
R111  1K0  [_1206]
R112  1K0  [_1206]
R113  1K0  [_1206]
R114  1K0  [_1206]
R115  1K0  [_1206]
R116  1K0  [_1206]
R117  10K  [_1206]
R118  10K  [_1206]
R119  2K7  [_1206]
R120  2K7  [_1206]
R121  1K0  [_1206]
R122  10K  [_1206]
R123  1K0  [_1206]
R124  1K0  [_1206]
R125  1K0  [_1206]
R126  10K  [_1206]
R127  10K  [_1206]
R128  10K  [_1206]
U4  MC14051BD  [SO-G16/C5.85]
U10  MC14051BD  [SO-G16/C5.85]
U11  MC14051BD  [SO-G16/C5.85]

### Nets
+3v3: U4.16(VDD) U10.16(VDD) U11.16(VDD)
+5v: R17.2 R18.2 R19.2 R115.2 R116.2 R121.2 R123.2 R124.2 R125.2
GND: C1.2 C2.2 C3.2 C4.2 C5.2 C6.2 C7.2 C8.2 C42.2 C43.2 C44.2 C45.2 C46.2 C47.2 C48.2 C49.2 C50.2 C51.2 C52.2 C53.2 C54.2 C55.2 D1.1(A) D3.1(A) D4.1(A) D5.1(A) D7.1(A) D8.1(A) Q2.3(S) Q3.3(S) Q4.3(S) Q7.3(S) R10.2 R12.2 R13.2 R14.2 R15.2 R16.2 R23.1 R24.1 R26.1 R27.1 R28.1 R74.2 R75.2 R76.2 R77.2 R78.2 R111.1 R112.1 R113.1 R114.1 R117.1 R118.1 R122.2 R126.2 R127.2 R128.2 U4.6(INH) U4.7(VEE) U4.8(VSS) U10.6(INH) U10.7(VEE) U10.8(VSS) U11.6(INH) U11.7(VEE) U11.8(VSS)
I1: R6.2
I2: R7.2
P0_19: Q2.1(G) R121.1 R122.1
P0_20: Q3.1(G) R123.1 R126.1
P0_21: Q4.1(G) R124.1 R127.1
P0_22: Q7.1(G) R125.1 R128.1
P0_23: U4.3(X)
P0_24: U10.3(X)
P0_25: U11.3(X)
P0_26: C42.1 D7.2(K) R71.1
P1_31: R16.1 R25.1
P2_10: U4.11(A) U10.11(A) U11.11(A)
P2_11: U4.10(B) U10.10(B) U11.10(B)
P2_12: U4.9(C) U10.9(C) U11.9(C)
R1: Q2.4(D)
R2: Q3.4(D)
R3: Q4.4(D)
R4: Q7.4(D)
SK1: R92.1
SK2: R94.1
SK3: R96.1
SK4: R98.1
T1: R8.2 R17.1
T2: R9.2 R18.1
T3: R11.2 R19.1
T4: R115.1 R119.2
T5: R116.1 R120.2
U1: R20.2
U2: R21.2
U3: R22.2
U4: R83.2
U5: R84.2
U6: R85.2
U7: R86.2
U8: R87.2
U9: R88.2
U10: R91.2
Ui1: C4.1 R6.1 R23.2 U11.15(X2)
Ui2: C5.1 R7.1 R24.2 U11.12(X3)
Us: R25.2
Usk1: C50.1 R93.2 R111.2 U4.13(X0)
Usk2: C51.1 R95.2 R112.2 U4.14(X1)
Usk3: C52.1 R97.2 R113.2 U4.15(X2)
Usk4: C53.1 R99.2 R114.2 U4.12(X3)
Ut1: C6.1 D3.2(K) R8.1 R26.2 U10.4(X7)
Ut2: C7.1 D4.2(K) R9.1 R27.2 U10.2(X6)
Ut3: C8.1 D5.2(K) R11.1 R28.2 U10.1(X4)
Ut4: C54.1 D1.2(K) R117.2 R119.1 U11.1(X4)
Ut5: C55.1 D8.2(K) R118.2 R120.1 U11.5(X5)
Uu1: C1.1 R12.1 R20.1 U4.1(X4)
Uu2: C2.1 R13.1 R21.1 U4.2(X6)
Uu3: C3.1 R15.1 R22.1 U4.5(X5)
Uu4: C43.1 R10.1 R83.1 U4.4(X7)
Uu5: C44.1 R14.1 R84.1 U10.12(X3)
Uu6: C45.1 R74.1 R85.1 U10.13(X0)
Uu7: C46.1 R75.1 R86.1 U10.14(X1)
Uu8: C47.1 R76.1 R87.1 U10.15(X2)
Uu9: C48.1 R77.1 R88.1 U10.5(X5)
Uu10: C49.1 R78.1 R91.1 U11.14(X1)
Vs: R71.2
NetR92_2: R92.2 R93.1
NetR94_2: R94.2 R95.1
NetR96_2: R96.2 R97.1
NetR98_2: R98.2 R99.1

Not connected (* = marked no-connect by the designer): U11 2(X6) 4(X7) 13(X0)

### Library data of the parts
C1-C8 C42-C55 = Cap Semi: as C22 on sheet cpu_board; Published: 8-Jun-2000; Revision: July-2002: Re-released for DXP Platform.; Publisher: Altium Limited; Class II: Capacitor
D1 D3-D5 D7 D8 = D Zener: Zener Diode; Manufacturer: Generic Components; Class I: Discrete; Class II: Diode - Zener; Published: 8-Jun-2000; Revision: July-2002: Re-released for DXP Platform.; Publisher: Altium Limited
Q2-Q4 Q7 = IRFR120: as Q100 on sheet power_board; Published: 8-Jun-2000; Datasheet: Latest Revision: PD-9.523D; Package Reference: TO-252AA; Publisher: Altium Limited
R6-R9 R11 R20-R28 R71 R83-R88 R91-R99 R111-R114 R117-R120 = Res2: as R34 on sheet cpu_board; Published: 8-Jun-2000; Revision: July-2002: Re-released for DXP Platform.; Publisher: Altium Limited; Class II: Resistor
  R6-R9 R11 R71 R119 R120: Value: 2K7
  R20-R22 R83-R88 R91: Value: 33K
  R23-R28 R117 R118: Value: 10K
  R92-R99: Value: 6K2
  R111-R114: Value: 1K0
R10 R12-R19 R74-R78 R115 R116 = Res2: Resistor; Manufacturer: Generic Components; Class I: Passive; Value: 1K; Rule: Undefined; Published: 8-Jun-2000; Revision: July-2002: Re-released for DXP Platform.; Publisher: Altium Limited; Class II: Resistor
R121-R128 = Res2: Resistor; Manufacturer: Generic Components; Class I: Passive; Value: 1K; Published: 8-Jun-2000; Revision: July-2002: Re-released for DXP Platform.; Publisher: Altium Limited; Class II: Resistor
U4 U10 U11 = MC14051BD: 8-Channel Analog Multiplexer/Demultiplexer; Manufacturer: ON Semiconductor; Class I: Logic; Class II: Multiplexer/Encoder/Selector; Published: 15-Apr-2002; Package Reference: 751B-05; Publisher: Altium Limited

## Nets that join several sheets
+3v3: cpu_board (17 pins), power_board (5 pins), eth_part (24 pins), analog_part (U4.16 U10.16 U11.16)
+5v: cpu_board (11 pins), power_board (5 pins), eth_part (R50.2), analog_part (9 pins)
+48v: cpu_board (JP1.5 JP1.6 R56.2), power_board (FU100.1)
-5v: cpu_board (C16.2 JP4.18 U9.4), power_board (C13.1 C57.2 C105.2 U102.1)
GND: cpu_board (49 pins), power_board (18 pins), eth_part (17 pins), analog_part (67 pins)
-48v: cpu_board (JP1.1 JP1.2), power_board (7 pins)
I1: cpu_board (JP1.47), analog_part (R6.2)
I2: cpu_board (JP1.48), analog_part (R7.2)
P0_19: cpu_board (U1.59), analog_part (Q2.1 R121.1 R122.1)
P0_20: cpu_board (U1.58), analog_part (Q3.1 R123.1 R126.1)
P0_21: cpu_board (U1.57), analog_part (Q4.1 R124.1 R127.1)
P0_22: cpu_board (U1.56), analog_part (Q7.1 R125.1 R128.1)
P0_23: cpu_board (U1.9), analog_part (U4.3)
P0_24: cpu_board (U1.8), analog_part (U10.3)
P0_25: cpu_board (U1.7), analog_part (U11.3)
P0_26: cpu_board (U1.6), analog_part (C42.1 D7.2 R71.1)
P1_0: cpu_board (U1.95), eth_part (U3.3)
P1_1: cpu_board (U1.94), eth_part (U3.4)
P1_4: cpu_board (U1.93), eth_part (U3.2)
P1_8: cpu_board (U1.92), eth_part (U3.40)
P1_9: cpu_board (U1.91), eth_part (U3.43)
P1_10: cpu_board (U1.90), eth_part (U3.44)
P1_14: cpu_board (U1.89), eth_part (U3.41)
P1_15: cpu_board (U1.88), eth_part (U3.34 U6.3)
P1_16: cpu_board (U1.87), eth_part (U3.31)
P1_17: cpu_board (U1.86), eth_part (U3.30)
P1_31: cpu_board (U1.20), analog_part (R16.1 R25.1)
P2_10: cpu_board (J1.6 R82.2 U1.53), analog_part (U4.11 U10.11 U11.11)
P2_11: cpu_board (U1.52), analog_part (U4.10 U10.10 U11.10)
P2_12: cpu_board (U1.51), analog_part (U4.9 U10.9 U11.9)
R1: cpu_board (JP1.35), analog_part (Q2.4)
R2: cpu_board (JP1.36), analog_part (Q3.4)
R3: cpu_board (JP1.33), analog_part (Q4.4)
R4: cpu_board (JP1.34), analog_part (Q7.4)
RES: cpu_board (D2.1 J1.2 R81.1 U1.17), eth_part (U3.29)
SK1: cpu_board (JP1.7), analog_part (R92.1)
SK2: cpu_board (JP1.8), analog_part (R94.1)
SK3: cpu_board (JP1.9), analog_part (R96.1)
SK4: cpu_board (JP1.10), analog_part (R98.1)
T1: cpu_board (JP1.45), analog_part (R8.2 R17.1)
T2: cpu_board (JP1.46), analog_part (R9.2 R18.1)
T3: cpu_board (JP1.43), analog_part (R11.2 R19.1)
T4: cpu_board (JP1.44), analog_part (R115.1 R119.2)
T5: cpu_board (JP1.41), analog_part (R116.1 R120.2)
U1: cpu_board (JP1.57), analog_part (R20.2)
U2: cpu_board (JP1.58), analog_part (R21.2)
U3: cpu_board (JP1.55), analog_part (R22.2)
U4: cpu_board (JP1.56), analog_part (R83.2)
U5: cpu_board (JP1.53), analog_part (R84.2)
U6: cpu_board (JP1.54), analog_part (R85.2)
U7: cpu_board (JP1.51), analog_part (R86.2)
U8: cpu_board (JP1.52), analog_part (R87.2)
U9: cpu_board (JP1.49), analog_part (R88.2)
U10: cpu_board (JP1.50), analog_part (R91.2)
Us: cpu_board (JP1.17), analog_part (R25.2)
Vbat: cpu_board (U1.19), power_board (D6.2)
Vs: cpu_board (JP1.18), analog_part (R71.2)